# Altium schematic sheet digitalBlock.SchDoc
size A1; PageSetup: Record=PageOptions|CenterHorizontal=True|CenterVertical=True|PrintScale=1.00|XCorrection=1.00|YCorrection=1.00|PrintKind=1|BorderSize=5000000|LeftOffset=0|BottomOffset=0|Orientation=2|PaperLength=1000|PaperWidth=1000|Scale=100|PaperSource=7|PrintQuality=-3|MediaType=1|DitherType=10|PrintScaleMode=1|PaperKind=Legal|PaperIndex=5
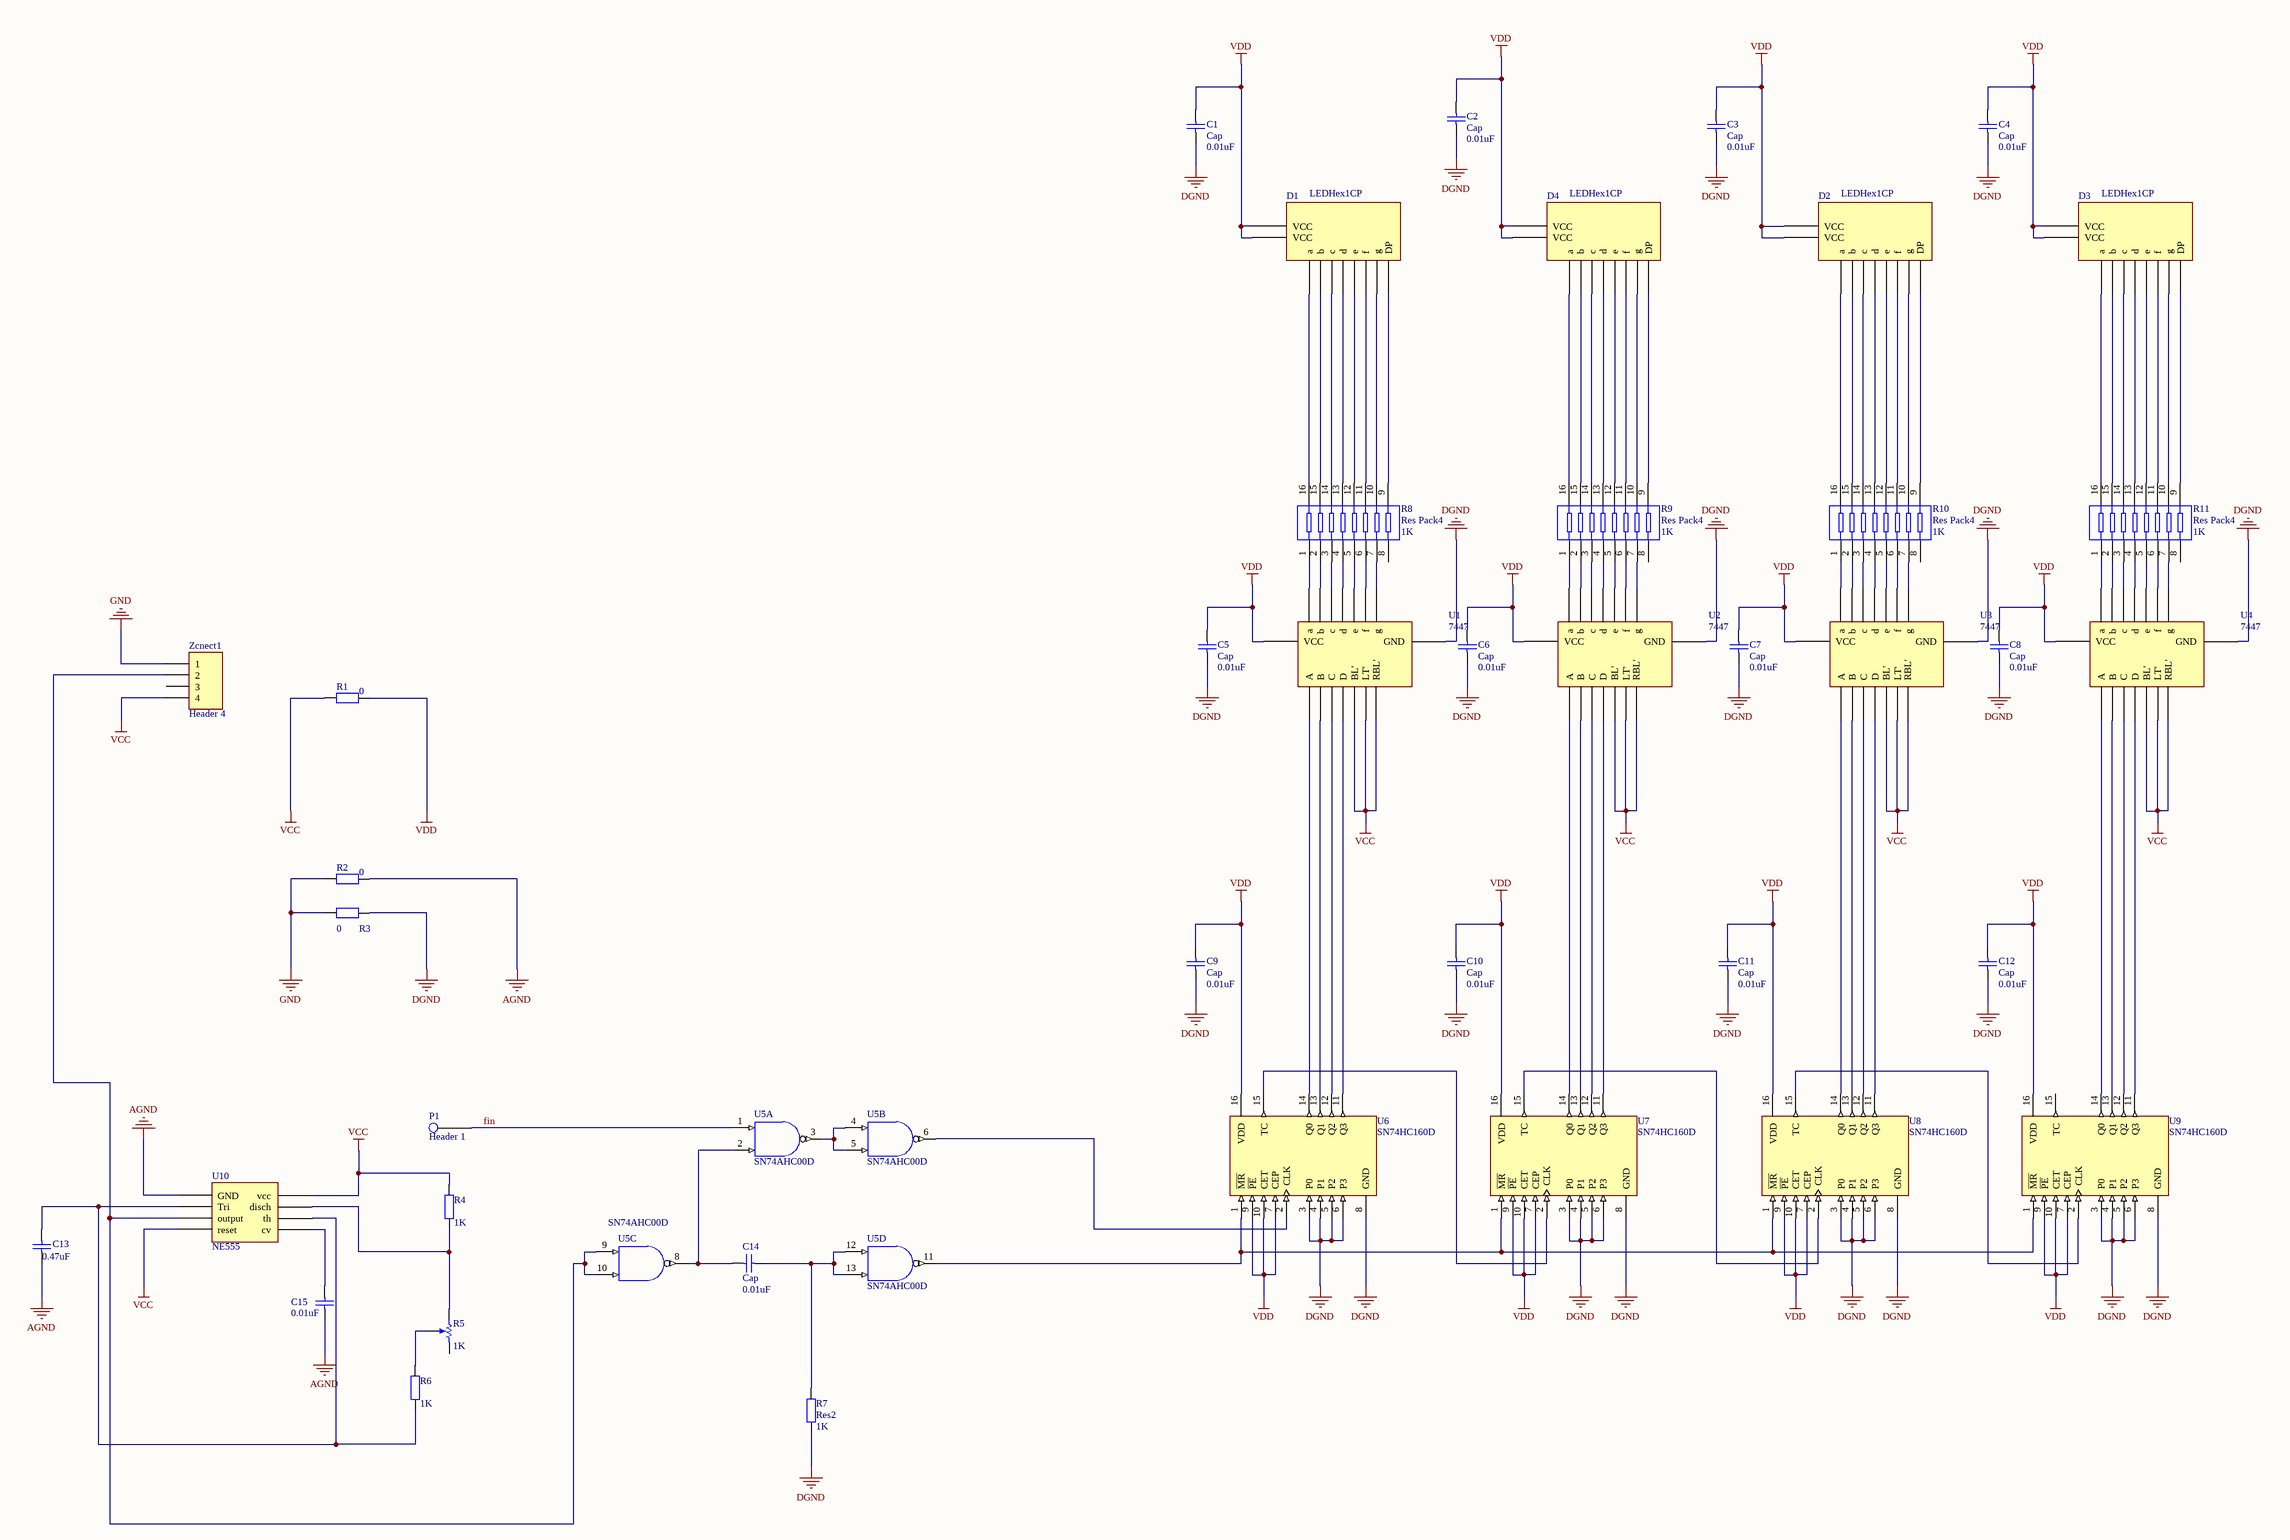
[diagram p0: digitalBlock.SchDoc]

## Parts
C1  Cap  value 0.01uF  [CAP-0603]
C2  Cap  value 0.01uF  [CAP-0603]
C3  Cap  value 0.01uF  [CAP-0603]
C4  Cap  value 0.01uF  [CAP-0603]
C5  Cap  value 0.01uF  [CAP-0603]
C6  Cap  value 0.01uF  [CAP-0603]
C7  Cap  value 0.01uF  [CAP-0603]
C8  Cap  value 0.01uF  [CAP-0603]
C9  Cap  value 0.01uF  [CAP-0603]
C10  Cap  value 0.01uF  [CAP-0603]
C11  Cap  value 0.01uF  [CAP-0603]
C12  Cap  value 0.01uF  [CAP-0603]
C13  value 0.47uF  [CAP-0603]  (hidden comment: Cap)
C14  Cap  value 0.01uF  [CAP-0603]
C15  value 0.01uF  [CAP-0603]  (hidden comment: Cap)
D1  LEDHex1CP  [LEDDIP-10/C5.08RHD]
D2  LEDHex1CP  [LEDDIP-10/C5.08RHD]
D3  LEDHex1CP  [LEDDIP-10/C5.08RHD]
D4  LEDHex1CP  [LEDDIP-10/C5.08RHD]
P1  Header 1  [HDR1*1]
R1  value 0  [RES-0603]  (hidden comment: Res2)
R2  value 0  [RES-0603]  (hidden comment: Res2)
R3  value 0  [RES-0603]  (hidden comment: Res2)
R4  value 1K  [RES-0603]  (hidden comment: Res2)
R5  value 1K  [VR5]  (hidden comment: RPot)
R6  value 1K  [RES-0603]  (hidden comment: Res2)
R7  Res2  value 1K  [RES-0603]
R8  Res Pack4  value 1K  [SSOP16]
R9  Res Pack4  value 1K  [SSOP16]
R10  Res Pack4  value 1K  [SSOP16]
R11  Res Pack4  value 1K  [SSOP16]
U1  7447  [SO-16]
U2  7447  [SO-16]
U3  7447  [SO-16]
U4  7447  [SO-16]
U5  SN74AHC00D  [SO-14]  (parts A,B,C,D of 4)
U6  SN74HC160D  [SO-16]
U7  SN74HC160D  [SO-16]
U8  SN74HC160D  [SO-16]
U9  SN74HC160D  [SO-16]
U10  NE555  [SO-8]
Zcnect1  Header 4  [HDR1X4]

## Nets
AGND: C13.1 C15.1 R2.2 U10.1(GND)
DGND: C1.1 C2.1 C3.1 C4.1 C5.1 C6.1 C7.1 C8.1 C9.1 C10.1 C11.1 C12.1 R3.2 R7.1 U1.8(GND) U2.8(GND) U3.8(GND) U4.8(GND) U6.3(P0) U6.4(P1) U6.5(P2) U6.6(P3) U6.8(GND) U7.3(P0) U7.4(P1) U7.5(P2) U7.6(P3) U7.8(GND) U8.3(P0) U8.4(P1) U8.5(P2) U8.6(P3) U8.8(GND) U9.3(P0) U9.4(P1) U9.5(P2) U9.6(P3) U9.8(GND)
GND: R2.1 R3.1 U5.7(GND) Zcnect1.1
VCC: R1.1 R4.2 U1.3(LT') U1.4(BL') U1.5(RBL') U2.3(LT') U2.4(BL') U2.5(RBL') U3.3(LT') U3.4(BL') U3.5(RBL') U4.3(LT') U4.4(BL') U4.5(RBL') U5.14(VCC) U10.4(reset) U10.8(vcc) Zcnect1.4
VDD: C1.2 C2.2 C3.2 C4.2 C5.2 C6.2 C7.2 C8.2 C9.2 C10.2 C11.2 C12.2 D1.1(VCC) D1.6(VCC) D2.1(VCC) D2.6(VCC) D3.1(VCC) D3.6(VCC) D4.1(VCC) D4.6(VCC) R1.2 U1.16(VCC) U2.16(VCC) U3.16(VCC) U4.16(VCC) U6.7(CEP) U6.9(~{PE}) U6.10(CET) U6.16(VDD) U7.7(CEP) U7.9(~{PE}) U7.10(CET) U7.16(VDD) U8.7(CEP) U8.9(~{PE}) U8.10(CET) U8.16(VDD) U9.7(CEP) U9.9(~{PE}) U9.10(CET) U9.16(VDD)
fin: P1.1(p) U5.1(A)
NetC13_2: C13.2 R6.1 U10.2(Tri) U10.6(th)
NetC14_1: C14.1 R7.2 U5.12(A) U5.13(B)
NetC14_2: C14.2 U5.2(B) U5.8(Y)
NetC15_2: C15.2 U10.5(cv)
NetD1_2: D1.2(f) R8.11
NetD1_3: D1.3(g) R8.10
NetD1_4: D1.4(e) R8.12
NetD1_5: D1.5(d) R8.13
NetD1_7: D1.7(DP) R8.9
NetD1_8: D1.8(c) R8.14
NetD1_9: D1.9(b) R8.15
NetD1_10: D1.10(a) R8.16
NetD2_2: D2.2(f) R10.11
NetD2_3: D2.3(g) R10.10
NetD2_4: D2.4(e) R10.12
NetD2_5: D2.5(d) R10.13
NetD2_7: D2.7(DP) R10.9
NetD2_8: D2.8(c) R10.14
NetD2_9: D2.9(b) R10.15
NetD2_10: D2.10(a) R10.16
NetD3_2: D3.2(f) R11.11
NetD3_3: D3.3(g) R11.10
NetD3_4: D3.4(e) R11.12
NetD3_5: D3.5(d) R11.13
NetD3_7: D3.7(DP) R11.9
NetD3_8: D3.8(c) R11.14
NetD3_9: D3.9(b) R11.15
NetD3_10: D3.10(a) R11.16
NetD4_2: D4.2(f) R9.11
NetD4_3: D4.3(g) R9.10
NetD4_4: D4.4(e) R9.12
NetD4_5: D4.5(d) R9.13
NetD4_7: D4.7(DP) R9.9
NetD4_8: D4.8(c) R9.14
NetD4_9: D4.9(b) R9.15
NetD4_10: D4.10(a) R9.16
NetR4_1: R4.1 R5.1(TOP) U10.7(disch)
NetR5_3: R5.3(TAP) R6.2
NetR8_1: R8.1 U1.13(a)
NetR8_2: R8.2 U1.12(b)
NetR8_3: R8.3 U1.11(c)
NetR8_4: R8.4 U1.10(d)
NetR8_5: R8.5 U1.9(e)
NetR8_6: R8.6 U1.15(f)
NetR8_7: R8.7 U1.14(g)
NetR9_1: R9.1 U2.13(a)
NetR9_2: R9.2 U2.12(b)
NetR9_3: R9.3 U2.11(c)
NetR9_4: R9.4 U2.10(d)
NetR9_5: R9.5 U2.9(e)
NetR9_6: R9.6 U2.15(f)
NetR9_7: R9.7 U2.14(g)
NetR10_1: R10.1 U3.13(a)
NetR10_2: R10.2 U3.12(b)
NetR10_3: R10.3 U3.11(c)
NetR10_4: R10.4 U3.10(d)
NetR10_5: R10.5 U3.9(e)
NetR10_6: R10.6 U3.15(f)
NetR10_7: R10.7 U3.14(g)
NetR11_1: R11.1 U4.13(a)
NetR11_2: R11.2 U4.12(b)
NetR11_3: R11.3 U4.11(c)
NetR11_4: R11.4 U4.10(d)
NetR11_5: R11.5 U4.9(e)
NetR11_6: R11.6 U4.15(f)
NetR11_7: R11.7 U4.14(g)
NetU1_1: U1.1(B) U6.13(Q1)
NetU1_2: U1.2(C) U6.12(Q2)
NetU1_6: U1.6(D) U6.11(Q3)
NetU1_7: U1.7(A) U6.14(Q0)
NetU2_1: U2.1(B) U7.13(Q1)
NetU2_2: U2.2(C) U7.12(Q2)
NetU2_6: U2.6(D) U7.11(Q3)
NetU2_7: U2.7(A) U7.14(Q0)
NetU3_1: U3.1(B) U8.13(Q1)
NetU3_2: U3.2(C) U8.12(Q2)
NetU3_6: U3.6(D) U8.11(Q3)
NetU3_7: U3.7(A) U8.14(Q0)
NetU4_1: U4.1(B) U9.13(Q1)
NetU4_2: U4.2(C) U9.12(Q2)
NetU4_6: U4.6(D) U9.11(Q3)
NetU4_7: U4.7(A) U9.14(Q0)
NetU5_3: U5.3(Y) U5.4(A) U5.5(B)
NetU5_6: U5.6(Y) U6.2(CLK)
NetU5_9: U5.9(A) U5.10(B) U10.3(output) Zcnect1.2
NetU5_11: U5.11(Y) U6.1(~{MR}) U7.1(~{MR}) U8.1(~{MR}) U9.1(~{MR})
NetU6_15: U6.15(TC) U7.2(CLK)
NetU7_15: U7.15(TC) U8.2(CLK)
NetU8_15: U8.15(TC) U9.2(CLK)

Not connected (* = marked no-connect by the designer): R5 2(BOT); R8 8; R9 8; R10 8; R11 8; U5 0(26); U9 15(TC); Zcnect1 3

## Library data of the parts
C1-C15 = Cap: Capacitor; Published: 8-Jun-2000; LatestRevisionDate: 17-Jul-2002; LatestRevisionNote: Re-released for DXP Platform.; PackageReference: RAD-0.3; Publisher: Altium Limited; PackageDescription: Radial Cap, Thru-Hole; 2 Leads; 0.3 in Pin Spacing
R1-R4 R6 R7 = Res2: Resistor; Published: 8-Jun-2000; LatestRevisionDate: 17-Jul-2002; LatestRevisionNote: Re-released for DXP Platform.; PackageReference: AXIAL-0.4; Publisher: Altium Limited; PackageDescription: Axial Device, Thru-Hole; 2 Leads; 0.4 in Pin Spacing
R5 = RPot: Potentiometer; pin to pad: 2>3 3>2; Sim Note: Enter the Resistance value and the set point into parameter fields.; Set Position: 0.5; Published: 8-Jun-2000; LatestRevisionDate: 17-Jul-2002; LatestRevisionNote: Re-released for DXP Platform.; PackageReference: VR5; Publisher: Altium Limited
R8-R11 = Res Pack4: Isolated Resistor Network; Published: 24-Mar-1999; LatestRevisionDate: 17-Jul-2002; LatestRevisionNote: Re-released for DXP Platform.; PackageReference: SSOP16; Publisher: Altium Limited; Code_JEDEC: MO-150-AC
U5 = SN74AHC00D: Quadruple 2-Input Positive-NAND Gate; Published: 8-Jun-2000; LatestRevisionDate: 13-Apr-2006; LatestRevisionNote: IPC-7351 Footprint Added.; DatasheetVersion: Jun-1998; PackageVersion: Jan-1998; PackageReference: D014; Publisher: Altium Limited; PackageDescription: 14-Pin Small Outline Integrated Circuit 1.27 mm Pitch; Code_IPC: SOIC127P600-14; ComponentLink1Description: Manufacturer Link; ComponentLink1URL: http://www.ti.com/; ComponentLink2Description: Datasheet; ComponentLink2URL: http://www-s.ti.com/sc/ds/sn74ahc00.pdf; ComponentLink3Description: Packaging Specification; ComponentLink3URL: http://focus.ti.com/lit/ml/mpds177/mpds177.pdf
U6-U9 = SN74HC160D: Synchronous 4-Bit Decade and Binary Counter; Published: 8-Jun-2000; LatestRevisionDate: 13-Apr-2006; LatestRevisionNote: IPC-7351 Footprint Added.; DatasheetVersion: Sep-1987; PackageVersion: Jan-1998; PackageReference: D016; Publisher: Altium Limited; PackageDescription: 16-Pin Small Outline Integrated Circuit 1.27 mm Pitch; Code_IPC: SOIC127P600-16; ComponentLink1Description: Manufacturer Link; ComponentLink1URL: http://www.ti.com/; ComponentLink2Description: Datasheet; ComponentLink2URL: http://www-s.ti.com/sc/ds/sn74hc160.pdf
Zcnect1 = Header 4: Header, 4-Pin; LatestRevisionDate: 17-Jul-2002; LatestRevisionNote: Re-released for DXP Platform.; Publisher: Altium Limited